# EAGLE design Qwiic_Hall_Effect_Sensor_TMAG5273_Mini (EAGLE 9.6.2)
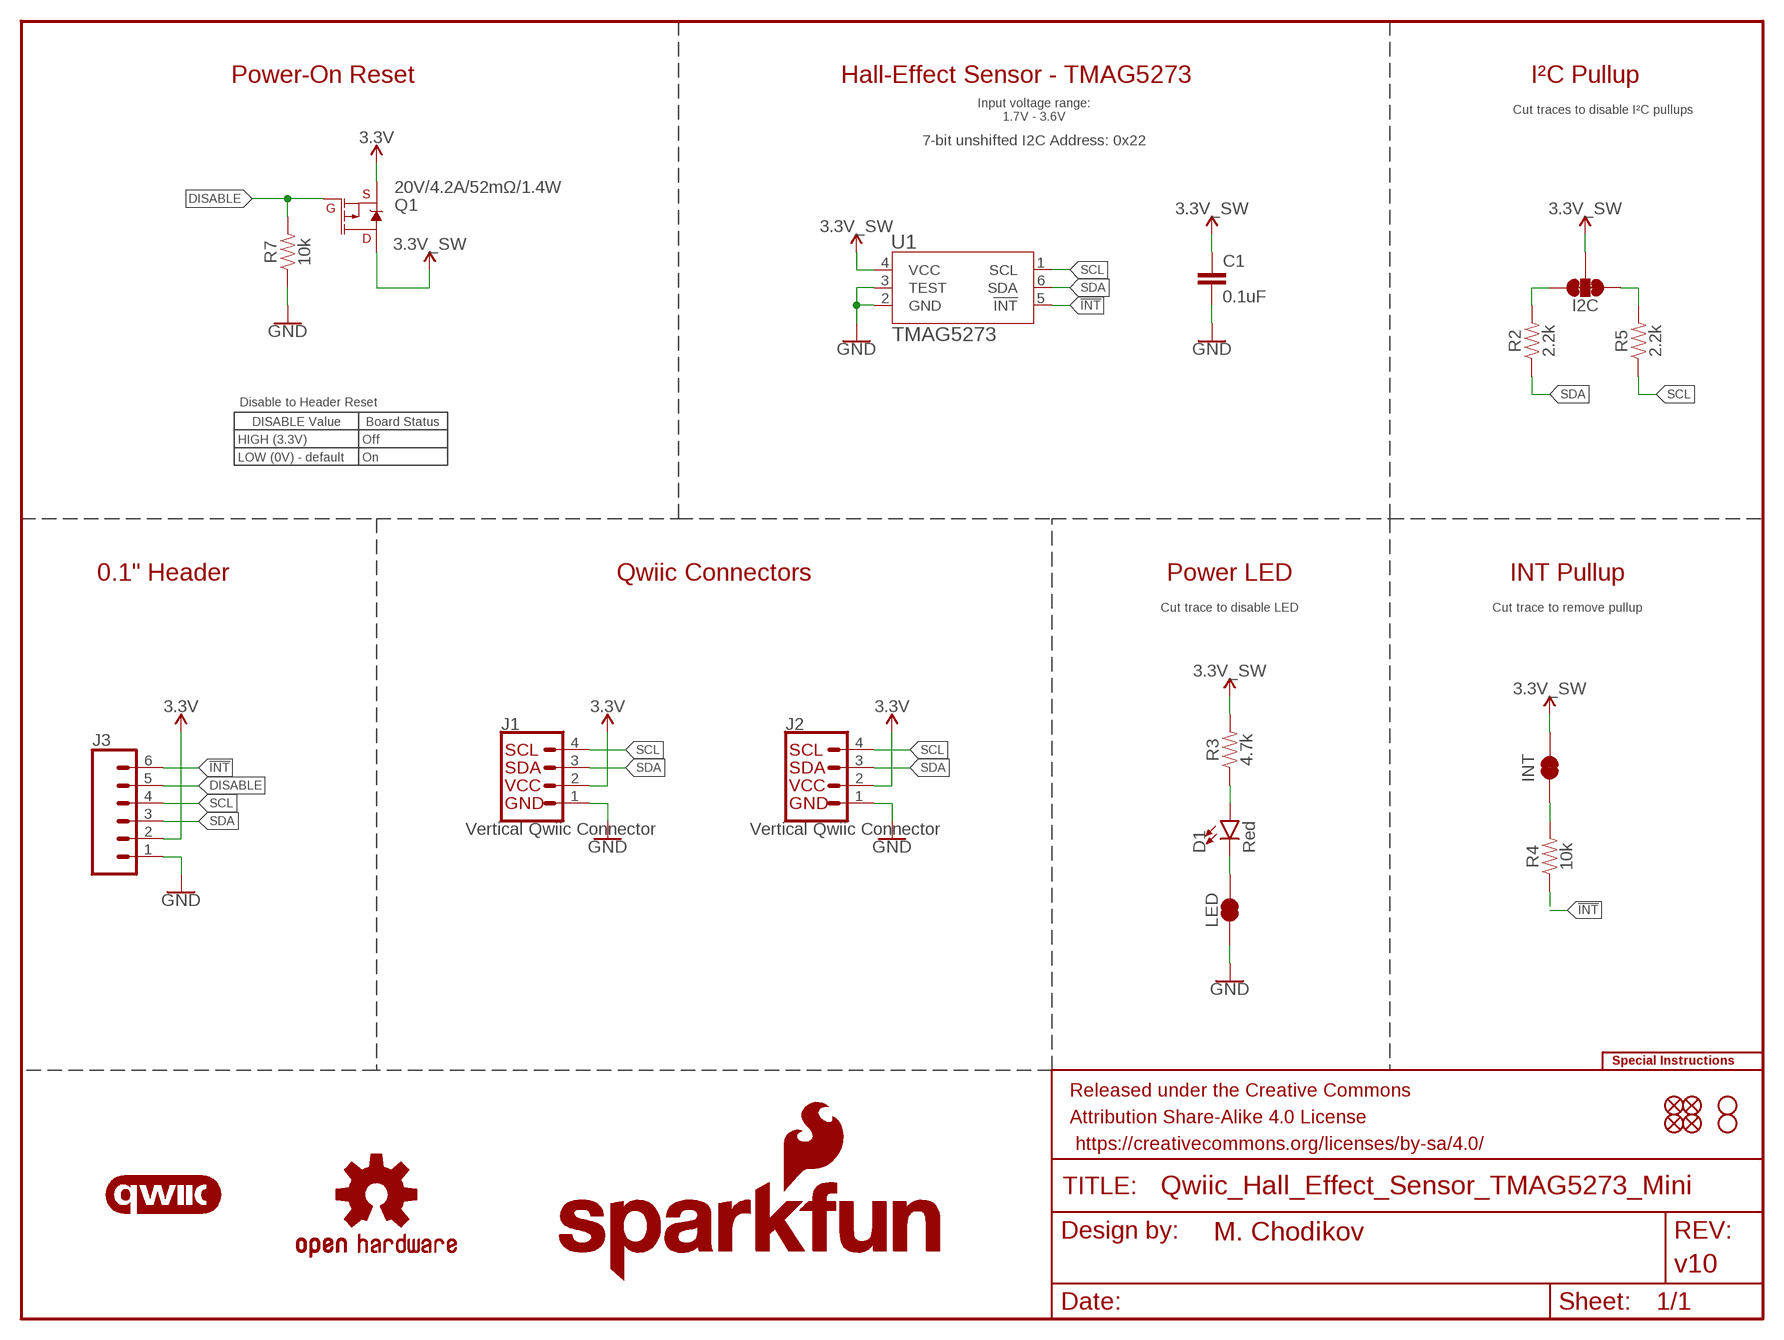
[diagram p0: schematic, sheet 1]

## Parts
C1  0.1uF  0.1UF-0603-25V-10%-X7R-WE  [0603]
D1  Red  LED-RED_0603-KB  [LED-0603]
FD1  FIDUCIAL1X2  [FIDUCIAL-1X2]
FD2  FIDUCIAL1X2  [FIDUCIAL-1X2]
FD3  FIDUCIAL1X2  [FIDUCIAL-1X2]
FD4  FIDUCIAL1X2  [FIDUCIAL-1X2]
FRAME1  FRAME-LETTER  [CREATIVE_COMMONS]
H2  STAND-OFF  [STAND-OFF]
H4  STAND-OFF  [STAND-OFF]
I2C  JUMPER-SMT_3_2-NC_TRACE_SILK  [SMT-JUMPER_3_2-NC_TRACE_SILK]
INT  JUMPER-SMT_2_NC_TRACE_SILK  [SMT-JUMPER_2_NC_TRACE_SILK]
J1  Vertical Qwiic Connector  QWIIC_CONNECTOR  [JST04_1MM_VERT]
J2  Vertical Qwiic Connector  QWIIC_CONNECTOR  [JST04_1MM_VERT]
J3  CONN_06NO_SILK_FEMALE_PTH  [1X06_NO_SILK]
LED  JUMPER-SMT_2_NC_TRACE_SILK  [SMT-JUMPER_2_NC_TRACE_SILK]
LOGO1  OSHW-LOGOMINI  [OSHW-LOGO-MINI]
LOGO2  SFE_LOGO_NAME_FLAME5_MM  [SFE_LOGO_NAME_FLAME_5MM]
LOGO3  QWIIC_LOGO_4MM  [QWIIC_4MM]
LOGO4  SFE_LOGO_NAME7_MM  [SFE_LOGO_NAME_7MM]
LOGO5  SPECIAL_INSTRUCTIONS-ORDERING  [ORDERING_INSTRUCTIONS]
LOGO6  SFE_LOGO_FLAME.1_INCH  [SFE_LOGO_FLAME_.1]
Q1  20V/4.2A/52mΩ/1.4W  MOSFET_PCH-DMG2305UX-7  [SOT23-3]
R2  2.2k  2.2KOHM-0603-1/10W-1%  [0603]
R3  4.7k  4.7KOHM-0603-1/10W-1%  [0603]
R4  10k  10KOHM-0603-1/10W-1%  [0603]
R5  2.2k  2.2KOHM-0603-1/10W-1%  [0603]
R7  10k  10KOHM-0603-1/10W-1%  [0603]
U1  TMAG5273  TMAG5273A1QDBVT  [SOT23-6_DBV_TEX]

## Nets
3.3V: J1.2 J2.2 J3.2 Q1.2(S)
3.3V_SW: C1.1 I2C.2 INT.2 Q1.3(D) R3.2 U1.4(VCC)
!INT: J3.6 R4.1 U1.5(!INT)
DISABLE: J3.5 Q1.1(G) R7.2
GND: C1.2 J1.1 J2.1 J3.1 LED.1 R7.1 U1.2(GND) U1.3(TEST)
N$1: D1.C LED.2
N$2: I2C.3 R2.2
N$4: D1.A R3.1
N$5: INT.1 R4.2
N$6: I2C.1 R5.2
SCL: J1.4 J2.4 J3.4 R5.1 U1.1(SCL)
SDA: J1.3 J2.3 J3.3 R2.1 U1.6(SDA)

## Notes on the sheet
- Power-On Reset | Hall-Effect Sensor - TMAG5273 | I²C Pullup
- Input voltage range:
  1.7V - 3.6V
- Cut traces to disable I²C pullups
- 7-bit unshifted I2C Address: 0x22
- Disable to Header Reset
- DISABLE Value | Board Status
- HIGH (3.3V) | Off
- LOW (0V) - default | On
- 0.1" Header | Qwiic Connectors | Power LED | INT Pullup
- Cut trace to disable LED | Cut trace to remove pullup

## Library data of the parts
C1 = SparkFun-Capacitors:0.1UF: 0.1µF ceramic capacitors A capacitor is a passive two-terminal electrical component used to store electrical energy temporarily in an electric field.; PROD_ID: CAP-16503
D1 = SparkFun-LED:LED-RED: Red SMD LED Used in manufacturing of most products at SparkFun Packages: 0603 - KB - KingBright (DIO-17976) SMD 0603 package [Datasheet] <https://www.kingbrightusa.com/images/catalog/SPEC/APT1608SURCK.pdf> 0603 - (DIO-00819, has gone EOL) SMD 0603 package 0603 SMART - SMD 0603 SMART package ( more efficient and expensive)[Product Link] <http://www.osram-os.com/Graphics/XPic2/00077099_0.pdf> 1206 - SMD1206 package [Product Link] <https://www.sparkfun.com/datasheets/DevTools/LilyPad/Q150OVS4.pdff> SparkFun Products: Pro Mini 328 -5V <https://www.sparkfun.com/products/821> RedBoard <https://www.sparkfun.com/products/12757> IOIO-OTG <https://www.sparkfun.com/products/13613>; PROD_ID: DIO-17976
FD1-FD4 = SparkFun-Aesthetics:FIDUCIAL: Fiducial Alignment Points Point-of-reference for pick-and-place machines and other optical instruments.
FRAME1 = SparkFun-Aesthetics:FRAME-LETTER: Schematic Frame - Letter Standard 8.5x11 US Letter frame; DESIGNER: M. Chodikov; REV: v10
H2 H4 = SparkFun-Hardware:STAND-OFF: Stand Off Drill holes for mechanically mounting via screws, standoffs, etc. Note: Use the keepout ring to avoid running the screw head into surrounding components. Variant Overviews STAND-OFF - Mechanical footprint for a #4 phillips button head screw. STAND-OFF-TIGHT - Mechanical footprint for a #4 phillips button head screw, Example SparkFun Products Screw - Phillips Head (1/4", 4-40, 10 pack) <https://www.sparkfun.com/products/10453> (PRT-10453) Screw - Phillips Head (1/2", 4-40, 10 pack) <https://www.sparkfun.com/products/10452> (PRT-10452) Screw - Phillips Head (3/4", 4-40, 10 pack) <https://www.sparkfun.com/products/10451> (PRT-10451) Screw - Phillips Head (1", 4-40, 10 pack) <https://www.sparkfun.com/products/10450> (PRT-10450)
I2C = SparkFun-Jumpers:JUMPER-SMT_3_2-NC_TRACE: Normally closed trace jumper (2 of 2 connections) This jumper has a trace between all three pads so they are normally closed (NC). Use a razor knife to open the connection(s). For best results follow the IPC guidelines for cutting traces: Cutout at least 0.063 mm (0.005 in). Remove all loose material to clean up the cut area. Seal the cut with an approved epoxy. Reapply solder to reclose the connection(s).
INT LED = SparkFun-Jumpers:JUMPER-SMT_2_NC_TRACE: Normally closed trace jumper This jumper has a trace between two pads so it's normally closed (NC). Use a razor knife to open the connection. For best results follow the IPC guidelines for cutting traces: Cutout at least 0.063 mm (0.005 in). Remove all loose material to clean up the cut area. Seal the cut with an approved epoxy. Reapply solder to reclose the connection.
J1 J2 = SparkFun-Connectors:QWIIC_CONNECTOR: SparkFun I2C Standard Qwiic Connector An SMD 1mm pitch JST connector makes it easy and quick (get it? Qwiic?) to connect I2C devices to each other. The Qwiic system <http://www.sparkfun.com/qwiic> enables fast and solderless connection between popular platforms and various sensors and actuators. We carry 200mm <https://www.sparkfun.com/products/14204>, 100mm <https://www.sparkfun.com/products/14205>, 50mm <https://www.sparkfun.com/products/14206>, and breadboard friendly <https://www.sparkfun.com/products/14207> Qwiic cables. We also offer 10 pcs strips <https://www.sparkfun.com/products/14323> the SMD connectors.; PROD_ID: CONN-14483
J3 = SparkFun-Connectors:CONN_06: Multi connection point. Often used as Generic Header-pin footprint for 0.1 inch spaced/style header connections On any of the 0.1 inch spaced packages, you can populate with these: Break Away Headers - Straight <https://www.sparkfun.com/products/116> (PRT-00116) Break Away Male Headers - Right Angle <https://www.sparkfun.com/products/553> (PRT-00553) Female Headers <https://www.sparkfun.com/products/115> (PRT-00115) Break Away Headers - Machine Pin <https://www.sparkfun.com/products/117> (PRT-00117) Break Away Female Headers - Swiss Machine Pin <https://www.sparkfun.com/products/743> (PRT-00743) Arduino Stackable Header - 6 Pin <https://www.sparkfun.com/products/9280> (PRT-09280) Screw Terminals 2.54mm Pitch (6-Pin) <https://www.sparkfun.com/products/16499> (PRT-16499) For SCREWTERMINALS and SPRING TERMINALS visit here: Screw Terimnals on SparkFun.com <https://www.sparkfun.com/search/results?term=Screw+Terminals> (5mm/3.5mm/2.54mm spacing) This device is also useful as a general connection point to wire up your design to another part of your project. Our various solder wires solder well into these plated through hole pads. Hook-Up Wire - Assortment (Stranded, 22 AWG) <https://www.sparkfun.com/products/11375> (PRT-11375) Hook-Up Wire - Assortment (Solid Core, 22 AWG) <https://www.sparkfun.com/products/11367> (PRT-11367) View the entire wire category on our website here <https://www.sparkfun.com/categories/141>; PROD_ID: CONN-08437
LOGO1 = SparkFun-Aesthetics:OSHW-LOGO: Open-Source Hardware (OSHW) Logo This logo indicates the piece of hardware it is found on incorporates a OSHW license and/or adheres to the definition of open source hardware found here: http://freedomdefined.org/OSHW
LOGO2 = SparkFun-Aesthetics:SFE_LOGO_NAME_FLAME: SparkFun Font Logo w/ Flame This is the SparkFun full logo. The logo on the schematic will always be the same size; the package variant is the height of the flame part of the logo. Default layer for the logo on the board is tSilk.
LOGO3 = SparkFun-Aesthetics:QWIIC_LOGO: Qwiic Logos for placement on schematic and PCB. The 5.5mm silk logo is best for placing next to Qwiic connector.
LOGO4 = SparkFun-Aesthetics:SFE_LOGO_NAME: SparkFun Font Logo This is the SparkFun name logo. The logo on the schematic will always be the same size; the package variant is the height of the flame part of the logo (or the height the flame would be, if it were drawn). Default layer for the logo on the board is tSilk.
LOGO5 = SparkFun-Aesthetics:SPECIAL_INSTRUCTIONS: Special Ordering/Production Instructions Alert Symbol for special PCB ordering instructions or unique production process warnings. Ordering Instructions Production Instructions Types of information that should be added to box: Copper weight Soldermask color Silk color PCB thickness Number of layers PCB Standard: 1.6mm FR4 1 oz copper immersion silver plating red soldermask white silkscreen Types of information that should be added to box: Special wash requirements Depaneling instructions Humidification Glue curing Default text settings: 0.07 inch 9% ratio 50% line distance
LOGO6 = SparkFun-Aesthetics:SFE_LOGO_FLAME: SparkFun Flame Logo This is the SparkFun flame logo. The logo on the schematic will always be the same size; the package variant is the height of the flame. Default layer for the logo on the board is tSilk.
Q1 = SparkFun-DiscreteSemi:MOSFET_PCH: P-channel MOSFETs Voltage controlled devices that allow control of high current outputs. SparkFun Products: SparkFun ESP32 Thing <https://www.sparkfun.com/products/13907> SparkFun ESP8266 Thing <https://www.sparkfun.com/products/13231> SparkFun Pi Servo HAT V2 <https://www.sparkfun.com/products/15316> DMG2305UX-7 (20V/4.2A/SOT23-3); PROD_ID: TRANS-14388
R2 R5 = SparkFun-Resistors:2.2KOHM: 2.2kΩ resistor A resistor is a passive two-terminal electrical component that implements electrical resistance as a circuit element. Resistors act to reduce current flow, and, at the same time, act to lower voltage levels within circuits. - Wikipedia; PROD_ID: RES-08272
R3 = SparkFun-Resistors:4.7KOHM: 4.7kΩ resistor A resistor is a passive two-terminal electrical component that implements electrical resistance as a circuit element. Resistors act to reduce current flow, and, at the same time, act to lower voltage levels within circuits. - Wikipedia; PROD_ID: RES-07857
R4 R7 = SparkFun-Resistors:10KOHM: 10kΩ resistor A resistor is a passive two-terminal electrical component that implements electrical resistance as a circuit element. Resistors act to reduce current flow, and, at the same time, act to lower voltage levels within circuits. - Wikipedia; PROD_ID: RES-00824
U1 = TMAG5273:TMAG5273A1QDBVT: Board Mount Hall Effect / Magnetic Sensors This IC is a low-power linear 3D hall-effect sensor with I2C interface. This device integrates three independent Hall-effect sensors in the X, Y, and Z axes. Datasheet <https://www.ti.com/lit/ds/symlink/tmag5273.pdf?HQS=dis-mous-null-mousermode-dsf-pf-null-wwe&ts=1679672375534&ref_url=https%253A%252F%252Fwww.mouser.co.uk%252F>; PROD_ID: ROB-18440

## Board
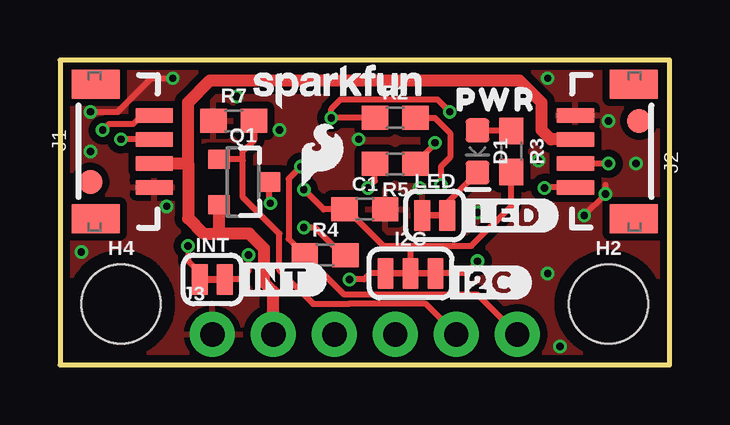
[diagram p1: board, top side]
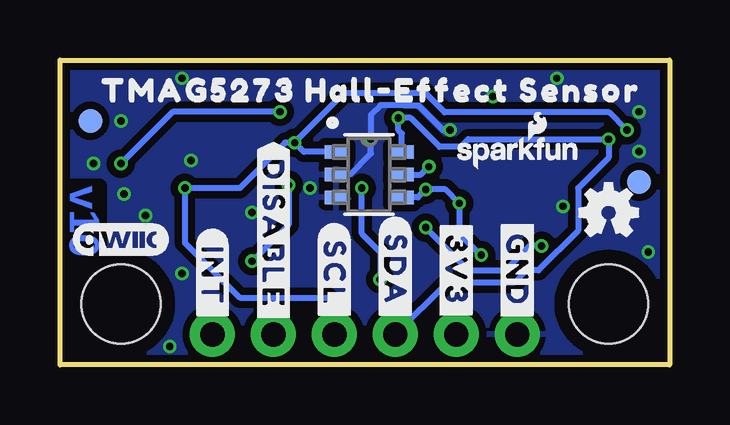
[diagram p2: board, bottom side, seen from below]

Size 25.4 x 12.7 mm. Coordinates in mm from the lower left corner, seen from the top.
Outline: 0,0 25.4,0 25.4,12.7 0,12.7 0,0
Copper layers (1*16): Top 0.035mm / dielectric 1.5mm / Bottom 0.035mm
Design rules "SparkFun-2-Layer-Minimum-JLCPCB": minimum track width 5mil, minimum drill 0.3mm, track to track 5mil, track to pad 5mil, pad to pad 5mil, via to via 5mil, smd to smd 5mil, copper to edge 7mil, drill to drill 7mil, minimum pad ring 5mil, minimum via ring 5mil, stop-mask expansion 2.5mil, vias tented up to drill 25mil, thermal gap 10mil

### Footprints (pad centres in the part's own frame; a part is rotated, then mirrored left to right if it is on the bottom)
0603 = smd 1.1 x 1: 1 -0.85,0; 2 0.85,0
LED-0603 = smd 1 x 1: A -0.877,0; C 0.877,0
FIDUCIAL-1X2 = smd 1 x 1: 1 0,0
STAND-OFF = hole 3.302: 0,0
SMT-JUMPER_3_2-NC_TRACE_SILK = smd 0.66 x 1.27: 1 -1.041,0; 2 0,0; 3 1.041,0
SMT-JUMPER_2_NC_TRACE_SILK = smd 0.66 x 1.27: 1 -0.521,0; 2 0.521,0
JST04_1MM_VERT = smd 0.6 x 1.55: 1 -1.5,0.775; 2 -0.5,0.775; 3 0.5,0.775; 4 1.5,0.775 | smd 1.2 x 2: NC1 -2.8,3.2; NC2 2.8,3.2
1X06_NO_SILK = drill 1.016 pad 1.88: 1 0,0; 2 2.54,0; 3 5.08,0; 4 7.62,0; 5 10.16,0; 6 12.7,0
SOT23-3 = smd 0.8 x 0.9: 1 -0.95,-1; 2 0.95,-1; 3 0,1.1
SOT23-6_DBV_TEX = smd 0.978 x 0.559: 1 -1.365,0.95; 2 -1.365,0; 3 -1.365,-0.95; 4 1.365,-0.95; 5 1.365,0; 6 1.365,0.95

### Placement (x,y rotation side)
C1  12.7,6.48 0 top
D1  17.4,8.89 270 top
FD1  24.13,10.16 0 top
FD2  1.27,7.62 0 top
FD3  1.27,7.62 0 bottom
FD4  24.13,10.16 0 bottom
FRAME1  -11.43,-24.13 0 top  (outside the outline)
H2  22.86,2.54 0 top
H4  2.54,2.54 0 top
I2C  14.61,3.81 0 top
INT  6.35,3.56 0 top
J1  4.7,8.89 90 top
J2  20.7,8.89 270 top
J3  6.35,1.27 0 top
LED  15.62,6.22 0 top
LOGO1  2.54,6.35 0 bottom
LOGO2  6.35,8.89 0 bottom
LOGO3  22.86,5.21 0 bottom
LOGO4  11.56,11.68 0 top
LOGO5  44.45,50.8 0 top  (outside the outline)
LOGO6  10.92,8.76 0 top
Q1  7.62,7.62 270 top
R2  13.97,10.29 0 top
R3  18.8,8.89 270 top
R4  11.05,4.57 0 top
R5  13.97,8.38 180 top
R7  7.24,10.16 0 top
U1  12.52,7.92 0 bottom
U$1  [PWR5282]  18.16,11.05 0 top
U$2  [#SCL#38]  13.97,3.81 270 bottom
U$3  [#SDA#37]  11.43,3.94 270 bottom
U$4  [#3V3#37]  8.89,3.94 270 bottom
U$5  [#GND#36]  6.35,3.94 270 bottom
U$6  [TMAG5273_HALL#EFFECT_SENSOR0]  12.45,11.43 0 bottom
U$7  [#DISABLE#5291]  16.51,5.46 270 bottom
U$8  [#I2C#5276]  17.78,3.43 0 top
U$9  [#INT#5285]  19.05,3.68 270 bottom
U$10  [#LED#5275]  18.67,6.22 0 top
U$12  [#INT#5287]  9.14,3.56 0 top

### Tracks (layer width: path | path; a pad name or v marks a point on that pad's centre or on a via)
3.3V
  Top 0.508: 5.33,8.39 5.33,10.92 6.25,11.84 19.15,11.84 20.07,10.92 20.07,9.78 20.45,9.39 J2.2 | J1.2 5.33,8.39 | 6.6,5.46 5.97,5.46 5.33,6.1 5.33,8.39 | Q1.2 6.62,5.48 6.6,5.46 | J3.2 8.89,3.05 8.51,3.43 8.51,4.85 7.89,5.46 6.6,5.46
3.3V_SW  (via drill 0.3)
  Top 0.254: R3.2 18.8,6.6 17.14,4.95 14.61,4.95 | 14.61,4.95 13.46,4.95 11.94,6.48 C1.1 10.99,6.48 v10.16,7.3 | I2C.2 14.61,4.95 | v8.76,6.73 8.72,6.77 Q1.3 | v7.85,4.57 7.85,3.91 7.49,3.56 INT.2
  Bottom 0.254: U1.4 10.49,6.97 v10.16,7.3 9.34,7.3 v8.76,6.73 8.76,5.46 7.87,4.57 v7.85,4.57
!INT  (via drill 0.3)
  Top 0.254: v10.03,8.26 9.53,7.75 9.53,5.25 R4.1 11.85,2.92 17.4,2.92 J3.6
  Bottom 0.254: U1.5 10.36,7.92 v10.03,8.26
DISABLE
  Top 0.254: 7.62,8.51 7.62,6.99 9.14,5.46 9.14,3.94 10.54,2.54 12.04,2.54 15.24,2.54 J3.5 | 7.62,8.51 7.62,8.89 8.09,9.36 R7.2 | 7.62,8.51 7.56,8.57 Q1.1
GND  (via drill 0.3)
  Top 0.254: v1.27,10.54 2.41,10.54 3.81,11.94 v4.7,11.94 | v21.84,6.22 v22.73,7.11 22.73,7.49
  Bottom 0.254: v9.14,9.78 9.17,9.75 9.4,9.75 10.45,10.79 11.06,10.79 11.08,10.82 12.04,10.82 12.45,10.41 v12.45,9.4 12.45,8.81 13.33,7.92 U1.2
  other vias: 14.99,7.37 22.86,10.16 4.45,6.6 7.37,11.18 20.32,3.81 19.94,8.51 24,8.38 17.4,6.35 1.27,8.89 20.32,11.94 20.83,0.76 0.89,4.7
  pour Top (isolate 0.305): 0,0 0,12.7 25.4,12.7 25.4,0
  pour Bottom (isolate 0.305): 0,0 0,12.7 25.4,12.7 25.4,0
N$1
  Top 0.254: LED.2 16.14,6.76 D1.C
N$2  (via drill 0.3)
  Top 0.254: R2.2 15.62,10.29 16.26,9.65 16.26,8.64 15.87,8.26 v15.87,7.5 | v17.4,4.32 16.89,3.81 I2C.3
  Bottom 0.254: v15.87,7.5 15.87,5.84 v17.4,4.32
N$4
  Top 0.254: D1.A 18.77,9.77 R3.1
N$5  (via drill 0.3)
  Top 0.254: INT.1 5.83,3.82 5.33,4.32 v5.33,4.95 | R4.2 11.77,4.57 10.63,5.71 v10.16,5.71
  Bottom 0.254: v5.33,4.95 5.84,4.95 6.86,3.94 8.38,3.94 v10.16,5.71
N$6  (via drill 0.3)
  Top 0.254: I2C.1 12.93,3.81 12.68,3.56 v12.06,3.56 | R5.2 13.12,7.66 v12.83,7.37
  Bottom 0.254: v12.83,7.37 12.83,5.46 12.06,4.7 v12.06,3.56
SCL  (via drill 0.3)
  Top 0.254: J1.4 3.4,10.39 3.05,10.03 2.03,10.03 v1.78,9.78 | v15.62,9.25 15.62,9.18 R5.1 | J2.4 20.22,7.39 v20.19,7.37
  Bottom 0.254: v1.78,9.78 2.52,10.52 9.37,10.52 10.19,11.33 13.56,11.33 15.62,9.27 v15.62,9.25 | v15.62,9.25 16.02,9.25 17.91,7.37 v20.19,7.37 20.19,5.08 17.91,2.79 14.22,2.79 13.97,2.54 J3.4 | U1.1 15.24,8.88 v15.62,9.25
SDA  (via drill 0.3)
  Top 0.254: J1.3 v2.55,9.39 v2.54,9.4 | R2.1 v11.3,10.29 11.3,10.67 11.68,11.05 15.73,11.05 v16.24,10.54 | J2.3 v22.85,8.39 v22.86,8.38
  Bottom 0.254: v22.86,8.38 20.7,10.54 v16.24,10.54 | J3.3 9.27,3.43 6.48,3.43 5.97,3.94 5.47,3.94 3.81,5.6 3.81,7.37 2.54,8.64 v2.54,9.4 8.38,9.4 8.7,9.08 9.59,9.08 10.79,10.29 v11.3,10.29 11.3,9.78 11.16,9.63 U1.6

### Text on the board
Bottom: v10
tDocu: Solder Mask: Red / Thickness: 1.6mm / Two layer design / Finish: HASL Lead-Free / Copper Weight: 1oz / Material: TG135-140 | M. Chodikov